# EAGLE design ACCEL_SENSOR (EAGLE 7.1.0)
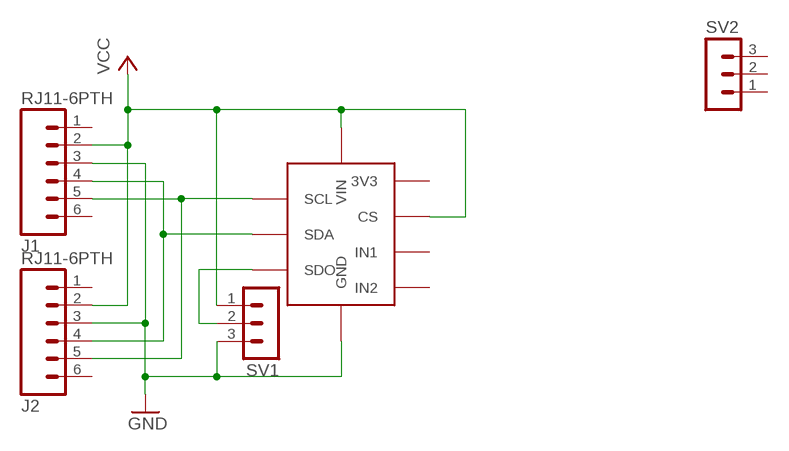
[diagram p0: schematic, sheet 1]

## Parts
J1  RJ11-6PTH  [RJ11-6]
J2  RJ11-6PTH  [RJ11-6]
SV1  MA03-1  [MA03-1]
SV2  MA03-1  [MA03-1]
U$1  ADXL345  [ADXL345]

## Nets
GND: J1.3 J2.3 SV1.3 U$1.GND
N$1: J1.4 J2.4 U$1.SDA
N$2: J1.5 J2.5 U$1.SCL
N$5: SV1.2 U$1.SDO
VCC: J1.2 J2.2 SV1.1 U$1.CS U$1.VIN
Unconnected: J1.1 J1.6 J2.1 J2.6 SV2.1 SV2.2 SV2.3 U$1.3V3 U$1.INT1(IN1) U$1.INT2(IN2)

## Library data of the parts
J1 J2 = BodyRockParts:RJ11-6: RJ11 Jack Simple 6 pin RJ11 jack. Commonly found on CAT3 devices and Microchip programmers. SKU: PRT-00132
SV1 SV2 = con-lstb:MA03-1: PIN HEADER; OC_FARNELL: unknown; OC_NEWARK: unknown
U$1 = BodyRockParts:ADXL345: ADXL345 Breakout Board Standard pin header footprint

## Board
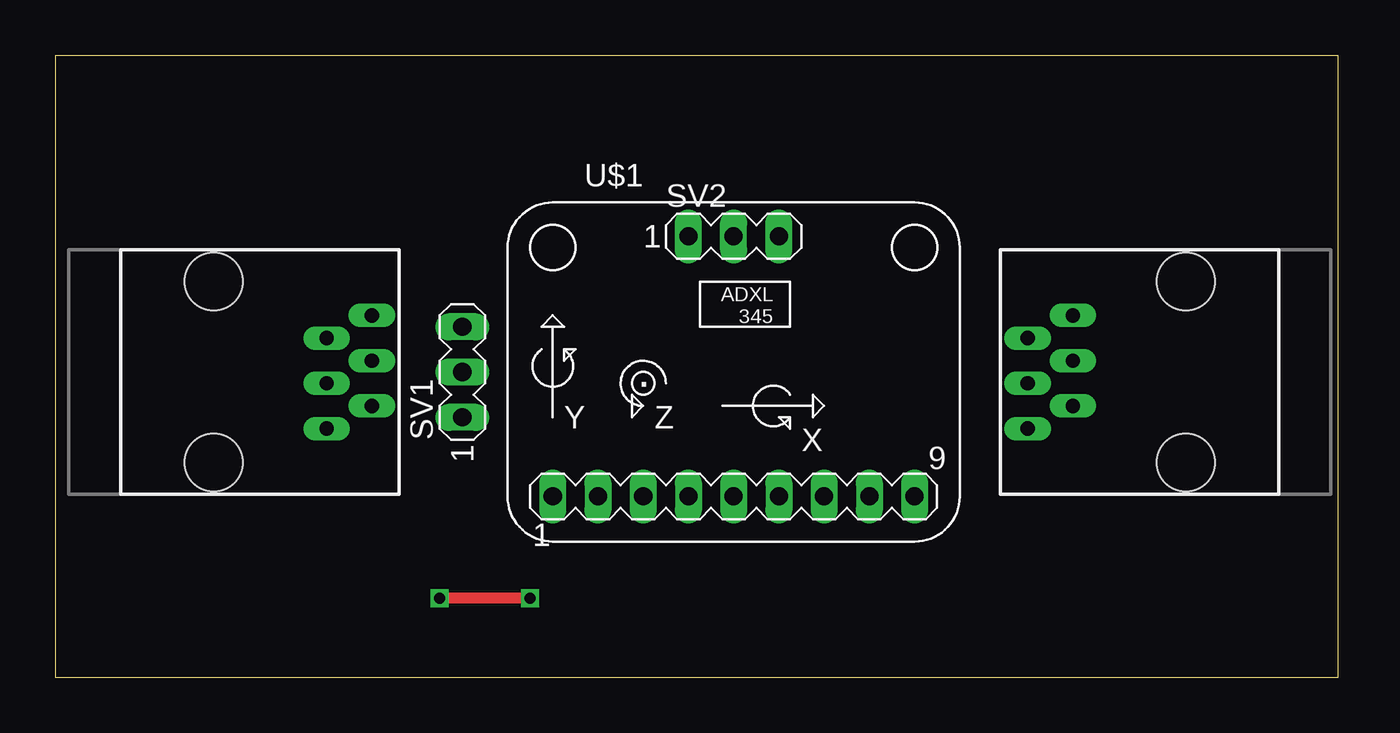
[diagram p1: board, top side]
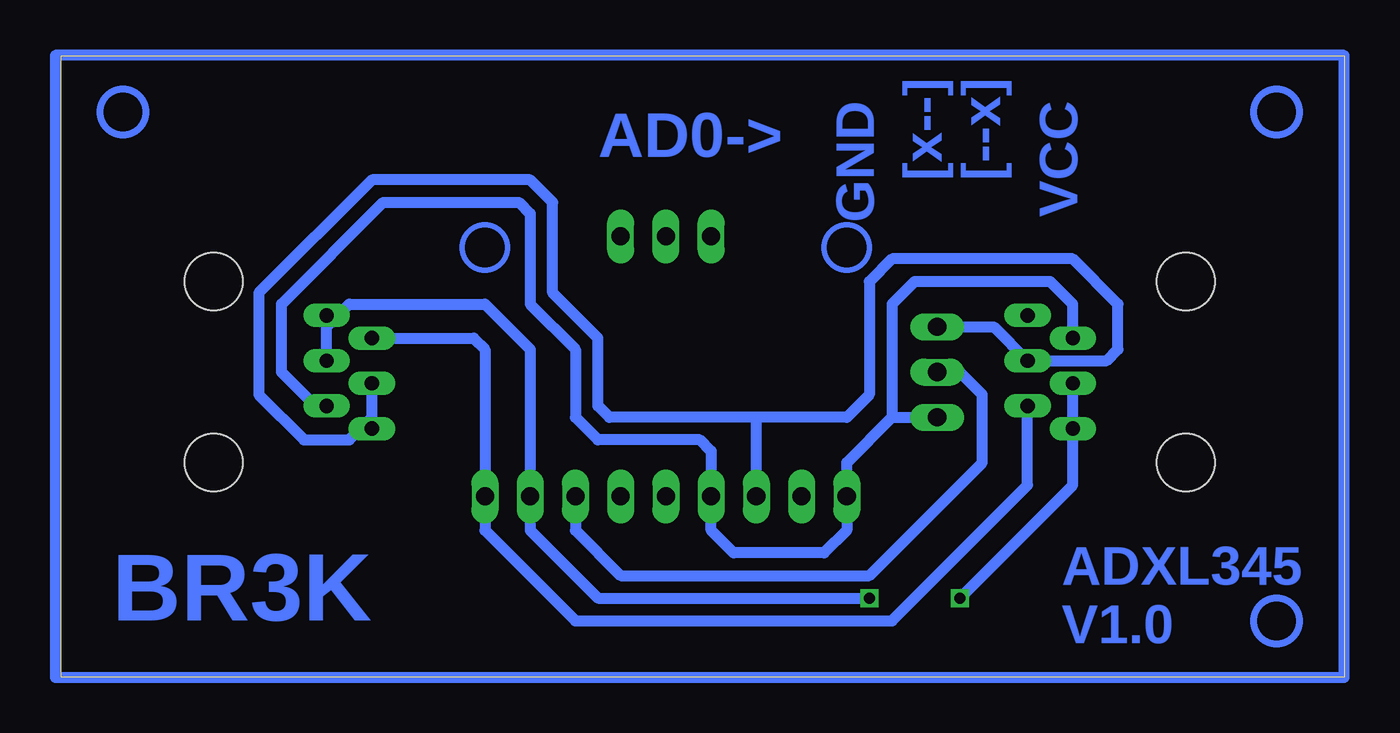
[diagram p2: board, bottom side, seen from below]

Size 72.06 x 34.92 mm. Coordinates in mm from the lower left corner, seen from the top.
Outline: 0,0 72.06,0 72.06,34.92 0,34.92 0,0
Copper layers (1*16): Top 0.035mm / dielectric 1.5mm / Bottom 0.035mm
Design rules "default *": minimum track width 10mil, minimum drill 24mil, track to track 8mil, track to pad 8mil, pad to pad 8mil, via to via 8mil, smd to smd 8mil, copper to edge 20mil, drill to drill 8mil, minimum pad ring 10mil, minimum via ring 8mil, stop-mask expansion 4mil, vias tented up to drill 0mil, thermal gap 10mil

### Footprints (pad centres in the part's own frame; a part is rotated, then mirrored left to right if it is on the bottom)
RJ11-6 = drill 0.8 long: 1 1.905,8.89; 2 3.175,6.35; 3 4.445,8.89; 4 5.715,6.35; 5 6.985,8.89; 6 8.255,6.35 | hole 3.251: 0,0; 10.16,0
MA03-1 = drill 1.016 long: 1 -2.54,0; 2 0,0; 3 2.54,0
ADXL345 = drill 1.016 long: 3V3 -7.62,0; CS -2.54,0; GND -5.08,0; INT1 0,0; INT2 2.54,0; SCL 10.16,0; SDA 7.62,0; SDO 5.08,0; VIN -10.16,0

### Placement (x,y rotation side)
J1  63.5,12.07 90 top
J2  8.89,22.22 270 top
SV1  22.86,17.14 90 top
SV2  38.1,24.76 0 top
U$1  38.1,10.16 0 top

### Tracks (layer width: path | path; a pad name or v marks a point on that pad's centre or on a via)
GND
  Bottom 0.61: U$1.GND 33.02,14.61 | J1.3 54.61,14.61 55.88,13.33 58.42,13.33 60.96,15.87 60.96,21.59 54.61,27.94 45.72,27.94 44.45,26.67 44.45,21.59 41.91,19.05 41.91,15.24 41.28,14.61 33.02,14.61 | SV1.3 19.69,19.68 J2.3 13.34,17.78 12.7,18.42 12.7,20.96 15.24,23.5 25.4,23.5 26.67,22.22 26.67,15.87 27.94,14.61 33.02,14.61
N$1  (via drill 0.61)
  Top 0.61: v26.67,4.45 v21.59,4.45
  Bottom 0.61: J1.4 57.15,19.68 55.88,20.96 48.26,20.96 45.72,18.42 U$1.SDA 45.72,8.25 41.91,4.45 v26.67,4.45 | v21.59,4.45 15.24,10.79 J2.4
N$2
  Bottom 0.61: J1.5 48.89,19.05 48.26,18.42 U$1.SCL 48.26,9.53 48.26,8.25 43.18,3.18 25.4,3.18 17.78,10.79 J2.5
N$3
  Bottom 0.61: 0,34.92 72.39,34.92 72.39,0 0,0 0,34.92
N$5
  Bottom 0.61: U$1.SDO 43.18,8.25 40.64,5.71 26.67,5.71 20.32,12.07 20.32,15.87 21.59,17.14 SV1.2
VCC
  Bottom 0.406: J1.2 57.78,15.24
  Bottom 0.61: 57.78,15.24 59.69,17.14 59.69,20.96 53.97,26.67 46.36,26.67 45.72,26.04 45.72,20.96 43.18,18.42 43.18,14.61 41.91,13.33 36.2,13.33 35.56,12.7 U$1.CS 35.56,8.25 34.29,6.99 29.21,6.99 27.94,8.25 U$1.VIN 27.94,12.07 25.4,14.61 | 25.4,14.61 SV1.1 | J2.2 15.24,20.96 16.51,22.22 24.13,22.22 25.4,20.96 25.4,14.61
(copper drawn outside any net)
  shapes: Bottom circle x9

### Text on the board
Bottom: [x--] / [--x] | VCC | GND | AD0-> | BR3K | ADXL345 / V1.0